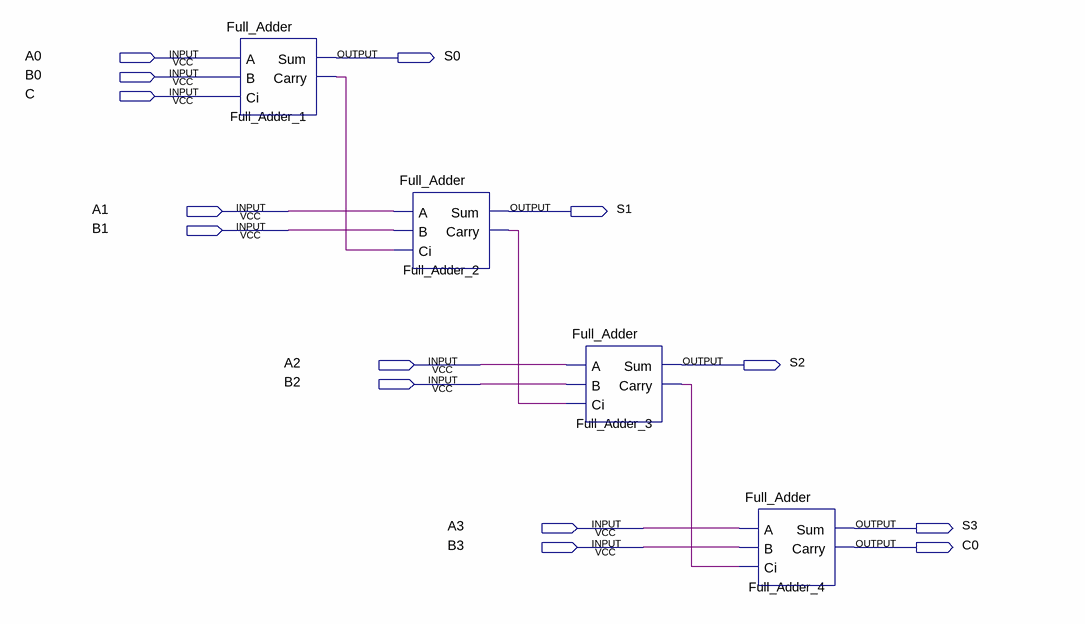
[diagram p0: schematic sheet]
// Quartus schematic Bit_Parallel_Adder_Encoder.bdf as structural Verilog: 4 symbols, 14 pins
module Bit_Parallel_Adder_Encoder (
  input  A0,
  input  B0,
  input  C,
  input  A1,
  input  B1,
  input  A2,
  input  B2,
  input  A3,
  input  B3,
  output S0,
  output S1,
  output S2,
  output S3,
  output C0
);

  wire Full_Adder_1_carry, Full_Adder_2_carry, Full_Adder_3_carry;

  Full_Adder Full_Adder_1 (.A(A0), .B(B0), .Ci(C), .Sum(S0), .Carry(Full_Adder_1_carry));
  Full_Adder Full_Adder_2 (.A(A1), .B(B1), .Ci(Full_Adder_1_carry), .Sum(S1), .Carry(Full_Adder_2_carry));
  Full_Adder Full_Adder_3 (.A(A2), .B(B2), .Ci(Full_Adder_2_carry), .Sum(S2), .Carry(Full_Adder_3_carry));
  Full_Adder Full_Adder_4 (.A(A3), .B(B3), .Ci(Full_Adder_3_carry), .Sum(S3), .Carry(C0));
endmodule
